# Altium schematic sheet bci02_corrected.SchDoc
size Tabloid
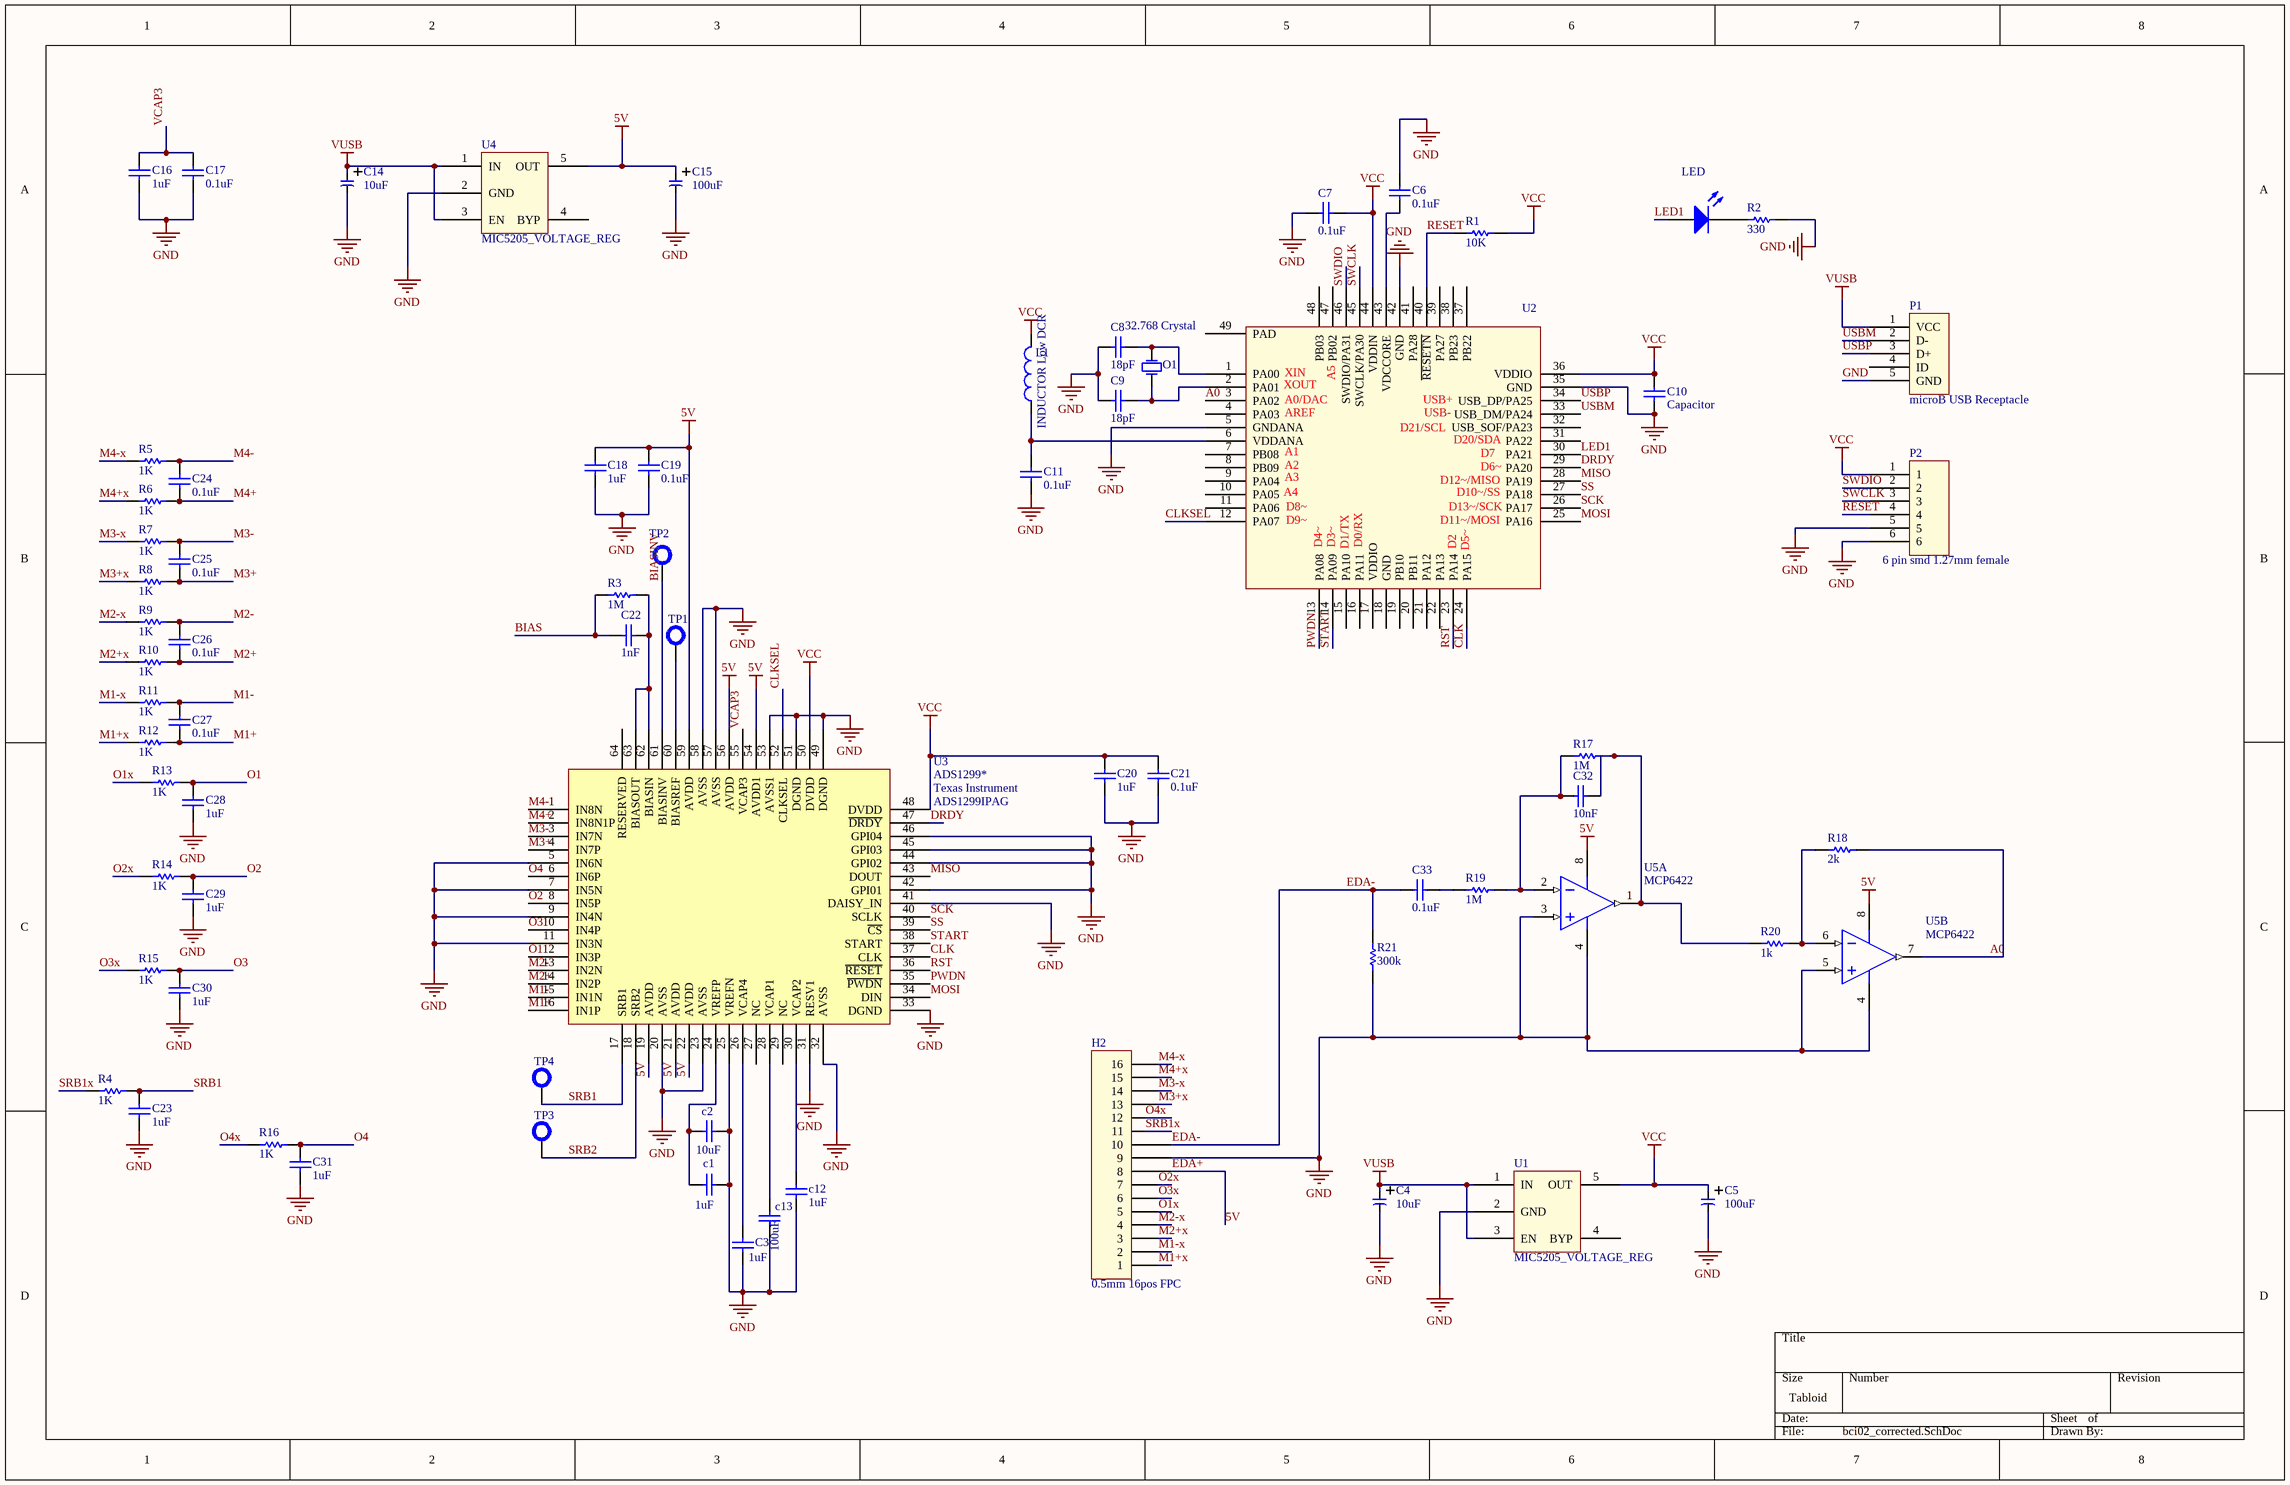
[diagram p0: bci02_corrected.SchDoc]

## Parts
c1  1uF  [3-0603]
c2  10uF  [3-0603]
C3  1uF  [3-0603]
C4  10uF  [3-0603]
C5  100uF  [3-0603]
C6  0.1uF  [3-0603]
C7  0.1uF  [3-0603]
C8  18pF  [3-0603]
C9  18pF  [3-0603]
C10  Capacitor  [3-0603]
C11  0.1uF  [3-0603]
c12  1uF  [3-0603]
c13  100uF  [3-0603]
C14  10uF  [3-0603]
C15  100uF  [3-0603]
C16  1uF  [3-0603]
C17  0.1uF  [3-0603]
C18  1uF  [3-0603]
C19  0.1uF  [3-0603]
C20  1uF  [3-0603]
C21  0.1uF  [3-0603]
C22  1nF  [3-0603]
C23  1uF  [0603W]
C24  0.1uF  [0603W]
C25  0.1uF  [0603W]
C26  0.1uF  [0603W]
C27  0.1uF  [0603W]
C28  1uF  [0603W]
C29  1uF  [0603W]
C30  1uF  [0603W]
C31  1uF  [0603W]
C32  10nF  [0603W]
C33  0.1uF  [0603W]
H2  0.5mm 16pos FPC  [FPC 16 PIN 0.5mm]
L1  INDUCTOR Low DCR  [3-0603]
LED1  LED  [0603W]
O1  32.768 Crystal  [32.768 Crystal]
P1  microB USB Receptacle  [MicroB USB Standarad SMT]
P2  6 pin smd 1.27mm female  [1.27mm smd female]
R1  10K  [3-0603]
R2  330  [3-0603]
R3  1M  [3-0603]
R4  1K  [0603W]
R5  1K  [0603W]
R6  1K  [0603W]
R7  1K  [0603W]
R8  1K  [0603W]
R9  1K  [0603W]
R10  1K  [0603W]
R11  1K  [0603W]
R12  1K  [0603W]
R13  1K  [0603W]
R14  1K  [0603W]
R15  1K  [0603W]
R16  1K  [0603W]
R17  1M  [0603W]
R18  2k  [0603W]
R19  1M  [0603W]
R20  1k  [0603W]
R21  300k  [0603W]
TP1  Test point small  [Test point small]  (value not drawn)
TP2  Test point small  [Test point small]  (value not drawn)
TP3  Test point small  [Test point small]  (value not drawn)
TP4  Test point small  [Test point small]  (value not drawn)
U1  MIC5205_VOLTAGE_REG  [SOT-23-CT5_M]
U2  Component_1  [TQFN48]  (value not drawn)
U3  ADS1299*  Mfr 1: Texas Instrument  Mfr 1 PN: ADS1299IPAG  [TI-PAG64_M]
U4  MIC5205_VOLTAGE_REG  [SOT-23-CT5_M]
U5  MCP6422  [MSOP-MS8_N]  (parts A,B of 2)

## Nets
5V: C15.1 C18.2 C19.2 H2.8 U3.19(AVDD) U3.21(AVDD) U3.22(AVDD) U3.54(AVDD1) U3.56(AVDD) U3.59(AVDD) U4.5(OUT) U5.8(VDD)  [also labelled EDA+]
GND: c1.2 c2.2 C3.2 C4.2 C5.2 C6.2 C7.2 C8.2 C9.2 C10.1 C11.1 c12.2 c13.2 C14.2 C15.2 C16.1 C17.1 C18.1 C19.1 C20.1 C21.1 C23.1 C28.1 C29.1 C30.1 C31.1 H2.9 P1.5(GND) P2.5 P2.6 R2.1 R21.1 U1.2(GND) U2.5(GNDANA) U2.35(GND) U2.42(GND) U3.5(IN6N) U3.7(IN5N) U3.9(IN4N) U3.11(IN3N) U3.20(AVSS) U3.23(AVSS) U3.25(VREFN) U3.31(RESV1) U3.32(AVSS) U3.33(DGND) U3.41(DAISY_IN) U3.42(GPI01) U3.44(GPI02) U3.45(GPI03) U3.46(GPI04) U3.49(DGND) U3.51(DGND) U3.53(AVSS1) U3.57(AVSS) U3.58(AVSS) U4.2(GND) U5.3(VINA+) U5.4(VSS) U5.5(VINB+)
VCC: C5.1 C7.1 C10.2 C20.2 C21.2 L1.2 P2.1 R1.1 U1.5(OUT) U2.36(VDDIO) U2.44(VDDIN) U3.48(DVDD) U3.50(DVDD)
VUSB: C4.1 C14.1 P1.1(VCC) U1.1(IN) U1.3(EN) U4.1(IN) U4.3(EN)
A0: R18.2 U2.3(PA02) U5.7(VOUTB)
BIAS: C22.1 R3.1
BIASINV: TP2.0 U3.61(BIASINV)
CLK: U2.24(PA15) U3.37(CLK)
CLKSEL: U2.12(PA07) U3.52(CLKSEL)
DRDY: U2.29(PA20) U3.47(~{DRDY})
EDA-: C33.2 H2.10 R21.2
LED1: LED1.1(A) U2.30(PA21)
M1+: C27.1 R12.1 U3.16(IN1P)
M1+x: H2.1 R12.2
M1-: C27.2 R11.1 U3.15(IN1N)
M1-x: H2.2 R11.2
M2+: C26.1 R10.1 U3.14(IN2P)
M2+x: H2.3 R10.2
M2-: C26.2 R9.1 U3.13(IN2N)
M2-x: H2.4 R9.2
M3+: C25.1 R8.1 U3.4(IN7P)
M3+x: H2.13 R8.2
M3-: C25.2 R7.1 U3.3(IN7N)
M3-x: H2.14 R7.2
M4+: C24.1 R6.1 U3.2(IN8N1P)
M4+x: H2.15 R6.2
M4-: C24.2 R5.1 U3.1(IN8N)
M4-x: H2.16 R5.2
MISO: U2.28(PA19) U3.43(DOUT)
MOSI: U2.25(PA16) U3.34(DIN)
O1: C28.2 R13.1 U3.12(IN3P)
O1x: H2.5 R13.2
O2: C29.2 R14.1 U3.8(IN5P)
O2x: H2.7 R14.2
O3: C30.2 R15.1 U3.10(IN4P)
O3x: H2.6 R15.2
O4: C31.2 R16.1 U3.6(IN6P)
O4x: H2.12 R16.2
PWDN: U2.13(PA08) U3.35(~{PWDN})
RESET: P2.4 R1.2 U2.40(~{RESETN})
RST: U2.23(PA14) U3.36(~{RESET})
SCK: U2.26(PA17) U3.40(SCLK)
SRB1: C23.2 R4.1 TP4.0 U3.17(SRB1)
SRB1x: H2.11 R4.2
SRB2: TP3.0 U3.18(SRB2)
SS: U2.27(PA18) U3.39(~{CS})
START: U2.14(PA09) U3.38(START)
SWCLK: P2.3 U2.45(SWCLK/PA30)
SWDIO: P2.2 U2.46(SWDIO/PA31)
USBM: P1.2(D-) U2.33(USB_DM/PA24)
USBP: P1.3(D+) U2.34(USB_DP/PA25)
VCAP3: C16.2 C17.2 U3.55(VCAP3)
Netc1_1: c1.1 c2.1 U3.24(VREFP)
NetC3_1: C3.1 U3.26(VCAP4)
NetC6_1: C6.1 U2.43(VDCCORE)
NetC8_1: C8.1 O1.1 U2.1(PA00)
NetC9_1: C9.1 O1.2 U2.2(PA01)
NetC11_2: C11.2 L1.1 U2.6(VDDANA)
Netc12_1: c12.1 U3.30(VCAP2)
Netc13_1: c13.1 U3.28(VCAP1)
NetC22_2: C22.2 R3.2 U3.62(BIASIN) U3.63(BIASOUT)
NetC32_1: C32.1 R17.2 R20.1 U5.1(VOUTA)
NetC32_2: C32.2 R17.1 R19.2 U5.2(VINA-)
NetC33_1: C33.1 R19.1
NetLED1_2: LED1.2(K) R2.2
NetR18_1: R18.1 R20.2 U5.6(VINB-)
NetTP1_0: TP1.0 U3.60(BIASREF)

Not connected (* = marked no-connect by the designer): P1 4(ID); U1 4(BYP); U2 4(PA03) 7(PB08) 8(PB09) 9(PA04) 10(PA05) 11(PA06) 15(PA10) 16(PA11) 17(VDDIO) 18(GND) 19(PB10) 20(PB11) 21(PA12) 22(PA13) 31(PA22) 32(USB_SOF/PA23) 37(PB22) 38(PB23) 39(PA27) 41(PA28) 47(PB02) 48(PB03) 49(PAD); U3 27(NC) 29(NC) 64(RESERVED); U4 4(BYP)

## Notes on the sheet
- (in symbol Component_1) XIN; A5; XOUT; A0/DAC; USB+; AREF; USB-; D21/SCL; D20/SDA; A1; D7; A2; D6~; A3; D12~/MISO; A4; D10~/SS; D8~; D13~/SCK; D9~; D11~/MOSI; D4~; D3~; D1/TX; D0/RX; D2; D5~

## Library data of the parts
c1 c2 C3 C6-C11 c12 c13 C16-C33 = Capacitor: SMD Cap 1206; digikey part number: *; manufacturer: *; manufacturer part number: *
C4 C5 C14 C15 = Polarized Cap
L1 = INDUCTOR Low DCR: Manufacturer: NR6028T470M; Digikey: 587-2104-1-ND
LED1 = LED: LED SMD 1206/0603; digikey part number: *; manufacturer part number: *; manufacturer: *
P1 = microB USB Receptacle: Manufacturer: ZX62-B-5PA(11); Digikey: H11634CT-ND; digikey part number 2: 609-4613-1-ND
R1-R21 = Resistor: digikey part number: *; manufacturer: *; manufacturer part number: *
U1 U4 = MIC5205_VOLTAGE_REG: 5V LDO SMD; Sparkfun #: PRT-1125
U3 = ADS1299: IC AFE 24BIT 16KSPS LN 64TQFP; Notes: SMD
U5 = MCP6422: 4.4 µA/Amplifier, 90 kHz Op Amp; manufacturer: Microchip Technology; manufacturer part number: MCP6422-E/MS; digikey part number: MCP6422-E/MS-ND
H2 = 0.5mm 16pos FPC: Supplier 1: Digikey; Supplier Part Number 1: 732-2023-1-ND
O1 = 32.768 Crystal: digikey number: XC1617CT-ND
P2 = 6 pin smd 1.27mm female: digikey: S9005E-06-ND
TP1-TP4 = Test point small: digikey number: 5000K-ND
U2 = Component_1: Supplier 1: Digi-Key